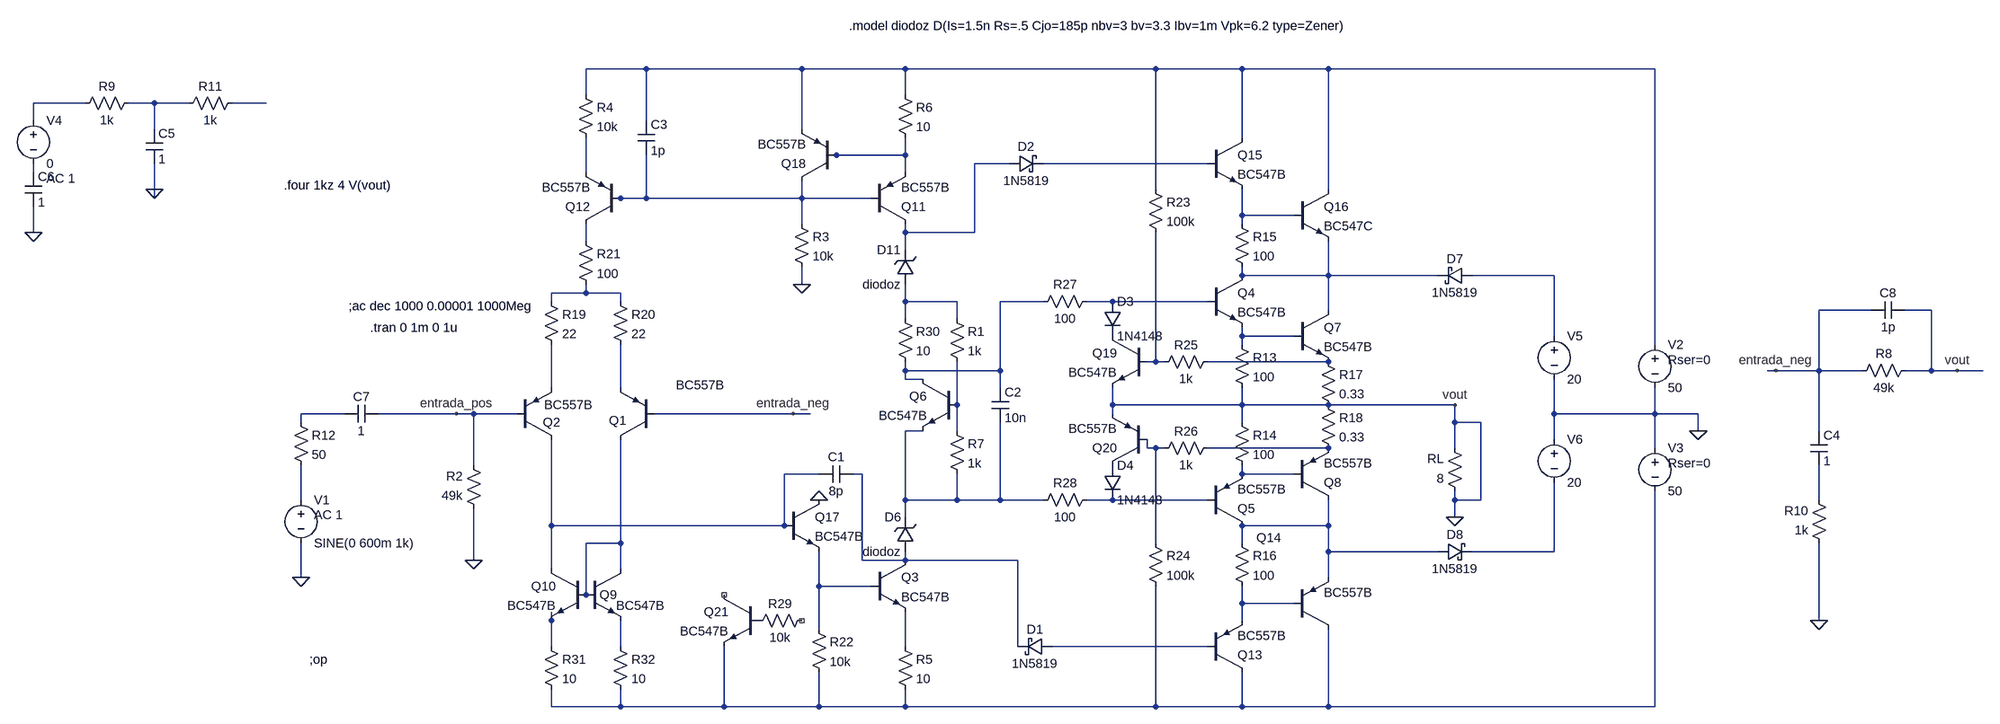
[diagram p0: schematic amplificador clase G con protecciones _ 2.asc]
amplificador clase G con protecciones _ 2.asc, the LTspice schematic file:
Version 4
SHEET 1 1412 756
WIRE -9376 -3552 -9488 -3552
WIRE -9088 -3552 -9376 -3552
WIRE -8896 -3552 -9088 -3552
WIRE -8432 -3552 -8896 -3552
WIRE -8272 -3552 -8432 -3552
WIRE -8112 -3552 -8272 -3552
WIRE -7360 -3552 -8112 -3552
WIRE -9488 -3504 -9488 -3552
WIRE -8896 -3504 -8896 -3552
WIRE -10416 -3488 -10512 -3488
WIRE -10288 -3488 -10336 -3488
WIRE -10224 -3488 -10288 -3488
WIRE -10080 -3488 -10144 -3488
WIRE -10512 -3456 -10512 -3488
WIRE -9376 -3456 -9376 -3552
WIRE -10288 -3440 -10288 -3488
WIRE -9088 -3440 -9088 -3552
WIRE -8272 -3424 -8272 -3552
WIRE -9024 -3392 -9040 -3392
WIRE -8896 -3392 -8896 -3424
WIRE -8896 -3392 -9024 -3392
WIRE -8704 -3376 -8768 -3376
WIRE -8336 -3376 -8640 -3376
WIRE -10512 -3360 -10512 -3376
WIRE -9488 -3360 -9488 -3424
WIRE -8896 -3360 -8896 -3392
WIRE -10288 -3328 -10288 -3376
WIRE -8432 -3328 -8432 -3552
WIRE -8112 -3328 -8112 -3552
WIRE -10288 -3312 -10288 -3328
WIRE -9424 -3312 -9440 -3312
WIRE -9376 -3312 -9376 -3392
WIRE -9376 -3312 -9424 -3312
WIRE -9088 -3312 -9088 -3344
WIRE -9088 -3312 -9376 -3312
WIRE -8960 -3312 -9088 -3312
WIRE -8272 -3280 -8272 -3328
WIRE -8176 -3280 -8272 -3280
WIRE -9088 -3264 -9088 -3312
WIRE -8272 -3264 -8272 -3280
WIRE -10512 -3248 -10512 -3296
WIRE -8896 -3248 -8896 -3264
WIRE -8768 -3248 -8768 -3376
WIRE -8768 -3248 -8896 -3248
WIRE -9488 -3232 -9488 -3264
WIRE -8896 -3216 -8896 -3248
WIRE -8272 -3168 -8272 -3184
WIRE -8112 -3168 -8112 -3232
WIRE -8112 -3168 -8272 -3168
WIRE -7888 -3168 -8112 -3168
WIRE -7600 -3168 -7824 -3168
WIRE -9088 -3152 -9088 -3184
WIRE -9488 -3136 -9488 -3152
WIRE -9488 -3136 -9552 -3136
WIRE -9424 -3136 -9488 -3136
WIRE -9552 -3120 -9552 -3136
WIRE -9424 -3120 -9424 -3136
WIRE -8896 -3120 -8896 -3152
WIRE -8800 -3120 -8896 -3120
WIRE -8640 -3120 -8720 -3120
WIRE -8512 -3120 -8560 -3120
WIRE -8336 -3120 -8512 -3120
WIRE -8112 -3104 -8112 -3168
WIRE -6960 -3104 -7056 -3104
WIRE -6848 -3104 -6896 -3104
WIRE -8896 -3088 -8896 -3120
WIRE -8800 -3088 -8800 -3120
WIRE -8272 -3056 -8272 -3072
WIRE -8176 -3056 -8272 -3056
WIRE -7600 -3056 -7600 -3168
WIRE -8272 -3040 -8272 -3056
WIRE -7360 -3040 -7360 -3552
WIRE -8432 -3008 -8432 -3248
WIRE -8432 -3008 -8448 -3008
WIRE -8416 -3008 -8432 -3008
WIRE -8112 -3008 -8336 -3008
WIRE -8896 -2992 -8896 -3008
WIRE -8720 -2992 -8720 -3120
WIRE -8720 -2992 -8896 -2992
WIRE -7136 -2992 -7152 -2992
WIRE -7056 -2992 -7056 -3104
WIRE -7056 -2992 -7136 -2992
WIRE -6976 -2992 -7056 -2992
WIRE -6848 -2992 -6848 -3104
WIRE -6848 -2992 -6896 -2992
WIRE -6800 -2992 -6848 -2992
WIRE -6752 -2992 -6800 -2992
WIRE -8896 -2976 -8896 -2992
WIRE -8864 -2976 -8896 -2976
WIRE -9552 -2960 -9552 -3040
WIRE -9424 -2960 -9424 -3040
WIRE -8720 -2960 -8720 -2992
WIRE -8800 -2928 -8800 -3008
WIRE -8512 -2928 -8512 -2960
WIRE -8272 -2928 -8272 -2960
WIRE -8272 -2928 -8512 -2928
WIRE -8112 -2928 -8272 -2928
WIRE -7856 -2928 -8112 -2928
WIRE -9936 -2912 -10016 -2912
WIRE -9728 -2912 -9872 -2912
WIRE -9696 -2912 -9728 -2912
WIRE -9616 -2912 -9696 -2912
WIRE -9104 -2912 -9360 -2912
WIRE -9072 -2912 -9104 -2912
WIRE -8512 -2912 -8512 -2928
WIRE -7600 -2912 -7600 -2976
WIRE -7360 -2912 -7360 -2960
WIRE -7360 -2912 -7600 -2912
WIRE -7280 -2912 -7360 -2912
WIRE -10016 -2896 -10016 -2912
WIRE -8272 -2896 -8272 -2928
WIRE -7856 -2896 -7856 -2928
WIRE -7808 -2896 -7856 -2896
WIRE -8864 -2880 -8896 -2880
WIRE -8800 -2880 -8800 -2928
WIRE -7280 -2880 -7280 -2912
WIRE -7056 -2880 -7056 -2992
WIRE -7600 -2864 -7600 -2912
WIRE -8448 -2848 -8448 -2864
WIRE -8432 -2848 -8448 -2848
WIRE -8416 -2848 -8432 -2848
WIRE -8112 -2848 -8336 -2848
WIRE -7856 -2848 -7856 -2896
WIRE -7360 -2848 -7360 -2912
WIRE -9696 -2816 -9696 -2912
WIRE -9056 -2800 -9120 -2800
WIRE -8976 -2800 -8992 -2800
WIRE -8272 -2800 -8272 -2816
WIRE -8176 -2800 -8272 -2800
WIRE -10016 -2752 -10016 -2816
WIRE -8896 -2752 -8896 -2880
WIRE -8800 -2752 -8800 -2800
WIRE -8800 -2752 -8896 -2752
WIRE -8720 -2752 -8720 -2896
WIRE -8720 -2752 -8800 -2752
WIRE -8640 -2752 -8720 -2752
WIRE -8512 -2752 -8560 -2752
WIRE -8336 -2752 -8512 -2752
WIRE -7856 -2752 -7856 -2768
WIRE -7808 -2752 -7808 -2896
WIRE -7808 -2752 -7856 -2752
WIRE -7056 -2752 -7056 -2816
WIRE -8896 -2720 -8896 -2752
WIRE -7856 -2720 -7856 -2752
WIRE -9552 -2704 -9552 -2864
WIRE -9120 -2704 -9120 -2800
WIRE -9120 -2704 -9552 -2704
WIRE -8112 -2704 -8112 -2752
WIRE -8112 -2704 -8272 -2704
WIRE -9424 -2672 -9424 -2864
WIRE -9424 -2672 -9488 -2672
WIRE -8432 -2672 -8432 -2848
WIRE -8272 -2672 -8272 -2704
WIRE -8112 -2656 -8112 -2704
WIRE -7888 -2656 -8112 -2656
WIRE -7600 -2656 -7600 -2784
WIRE -7600 -2656 -7824 -2656
WIRE -9696 -2640 -9696 -2736
WIRE -8976 -2640 -8976 -2800
WIRE -8896 -2640 -8896 -2656
WIRE -8896 -2640 -8976 -2640
WIRE -8688 -2640 -8896 -2640
WIRE -9552 -2624 -9552 -2704
WIRE -9424 -2624 -9424 -2672
WIRE -10016 -2608 -10016 -2672
WIRE -8112 -2608 -8112 -2656
WIRE -9056 -2592 -9056 -2656
WIRE -8960 -2592 -9056 -2592
WIRE -9488 -2576 -9488 -2672
WIRE -8272 -2560 -8272 -2592
WIRE -8176 -2560 -8272 -2560
WIRE -9552 -2528 -9552 -2544
WIRE -8272 -2528 -8272 -2560
WIRE -7056 -2528 -7056 -2672
WIRE -9056 -2512 -9056 -2592
WIRE -9552 -2480 -9552 -2528
WIRE -9424 -2480 -9424 -2528
WIRE -8896 -2480 -8896 -2544
WIRE -8688 -2480 -8688 -2640
WIRE -8336 -2480 -8624 -2480
WIRE -9552 -2368 -9552 -2400
WIRE -9424 -2368 -9424 -2400
WIRE -9424 -2368 -9552 -2368
WIRE -9232 -2368 -9232 -2480
WIRE -9232 -2368 -9424 -2368
WIRE -9056 -2368 -9056 -2432
WIRE -9056 -2368 -9232 -2368
WIRE -8896 -2368 -8896 -2400
WIRE -8896 -2368 -9056 -2368
WIRE -8432 -2368 -8432 -2592
WIRE -8432 -2368 -8896 -2368
WIRE -8272 -2368 -8272 -2432
WIRE -8272 -2368 -8432 -2368
WIRE -8112 -2368 -8112 -2512
WIRE -8112 -2368 -8272 -2368
WIRE -7360 -2368 -7360 -2768
WIRE -7360 -2368 -8112 -2368
FLAG -7280 -2880 0
FLAG -9696 -2640 0
FLAG -7856 -2720 0
FLAG -7856 -2928 vout
FLAG -10288 -3328 0
FLAG -10512 -3248 0
FLAG -10016 -2608 0
FLAG -7056 -2528 0
FLAG -7136 -2992 entrada_neg
FLAG -9104 -2912 entrada_neg
FLAG -6800 -2992 vout
FLAG -9728 -2912 entrada_pos
FLAG -9088 -3152 0
FLAG -9056 -2752 0
SYMBOL res -9504 -3520 R0
SYMATTR InstName R4
SYMATTR Value 10k
SYMBOL res -9680 -2720 R180
WINDOW 0 36 76 Left 2
WINDOW 3 36 40 Left 2
SYMATTR InstName R2
SYMATTR Value 49k
SYMBOL res -8912 -2496 R0
SYMATTR InstName R5
SYMATTR Value 10
SYMBOL res -8912 -3520 R0
SYMATTR InstName R6
SYMATTR Value 10
SYMBOL res -6880 -3008 R90
WINDOW 0 0 56 VBottom 2
WINDOW 3 32 56 VTop 2
SYMATTR InstName R8
SYMATTR Value 49k
SYMBOL res -7040 -2656 R180
WINDOW 0 36 76 Left 2
WINDOW 3 36 40 Left 2
SYMATTR InstName R10
SYMATTR Value 1k
SYMBOL res -7840 -2752 R180
WINDOW 0 36 76 Left 2
WINDOW 3 36 40 Left 2
SYMATTR InstName RL
SYMATTR Value 8
SYMBOL voltage -7360 -3056 R0
WINDOW 123 0 0 Left 2
WINDOW 39 24 44 Left 2
SYMATTR SpiceLine Rser=0
SYMATTR InstName V2
SYMATTR Value 50
SYMBOL voltage -7360 -2864 R0
WINDOW 123 0 0 Left 2
WINDOW 39 24 44 Left 2
SYMATTR SpiceLine Rser=0
SYMATTR InstName V3
SYMATTR Value 50
SYMBOL pnp -9360 -2864 R180
WINDOW 0 53 35 Left 2
WINDOW 3 -128 101 Left 2
SYMATTR InstName Q1
SYMATTR Value BC557B
SYMBOL pnp -9616 -2864 M180
WINDOW 0 48 32 Left 2
WINDOW 3 51 64 Left 2
SYMATTR InstName Q2
SYMATTR Value BC557B
SYMBOL npn -8960 -2640 R0
SYMATTR InstName Q3
SYMATTR Value BC547B
SYMBOL npn -8336 -3168 R0
SYMATTR InstName Q4
SYMATTR Value BC547B
SYMBOL cap -7072 -2880 R0
SYMATTR InstName C4
SYMATTR Value 1
SYMBOL pnp -8336 -2704 M180
SYMATTR InstName Q5
SYMATTR Value BC557B
SYMBOL npn -8800 -2976 M0
SYMATTR InstName Q6
SYMATTR Value BC547B
SYMBOL res -8816 -3104 R0
SYMATTR Value 1k
SYMATTR InstName R1
SYMBOL res -8816 -2896 R0
SYMATTR InstName R7
SYMATTR Value 1k
SYMBOL cap -8736 -2960 R0
SYMATTR InstName C2
SYMATTR Value 10n
SYMBOL res -10320 -3504 R90
WINDOW 0 0 56 VBottom 2
WINDOW 3 32 56 VTop 2
SYMATTR InstName R9
SYMATTR Value 1k
SYMBOL res -10128 -3504 R90
WINDOW 0 0 56 VBottom 2
WINDOW 3 32 56 VTop 2
SYMATTR InstName R11
SYMATTR Value 1k
SYMBOL cap -10304 -3440 R0
SYMATTR InstName C5
SYMATTR Value 1
SYMBOL cap -10528 -3360 R0
SYMATTR InstName C6
SYMATTR Value 1
SYMBOL voltage -10512 -3472 R0
WINDOW 123 24 124 Left 2
WINDOW 39 0 0 Left 2
SYMATTR Value2 AC 1
SYMATTR InstName V4
SYMATTR Value 0
SYMBOL voltage -10016 -2768 R0
WINDOW 123 24 44 Left 2
WINDOW 39 0 0 Left 2
SYMATTR Value2 AC 1
SYMATTR InstName V1
SYMATTR Value SINE(0 600m 1k)
SYMBOL res -10032 -2912 R0
SYMATTR InstName R12
SYMATTR Value 50
SYMBOL cap -9872 -2928 R90
WINDOW 0 0 32 VBottom 2
WINDOW 3 32 32 VTop 2
SYMATTR InstName C7
SYMATTR Value 1
SYMBOL npn -8176 -3104 R0
SYMATTR InstName Q7
SYMATTR Value BC547B
SYMBOL pnp -8176 -2752 M180
SYMATTR InstName Q8
SYMATTR Value BC557B
SYMBOL res -8288 -3056 R0
SYMATTR InstName R13
SYMATTR Value 100
SYMBOL res -8288 -2912 R0
SYMATTR InstName R14
SYMATTR Value 100
SYMBOL npn -9488 -2624 R0
WINDOW 0 25 48 Left 2
SYMATTR InstName Q9
SYMATTR Value BC547B
SYMBOL npn -9488 -2624 M0
SYMATTR InstName Q10
SYMATTR Value BC547B
SYMBOL pnp -8960 -3264 M180
SYMATTR InstName Q11
SYMATTR Value BC557B
SYMBOL pnp -9424 -3264 R180
SYMATTR InstName Q12
SYMATTR Value BC557B
SYMBOL pnp -8336 -2432 M180
SYMATTR InstName Q13
SYMATTR Value BC557B
SYMBOL pnp -8176 -2512 M180
WINDOW 0 -69 170 Left 2
SYMATTR InstName Q14
SYMATTR Value BC557B
SYMBOL npn -8336 -3424 R0
SYMATTR InstName Q15
SYMATTR Value BC547B
SYMBOL npn -8176 -3328 R0
SYMATTR InstName Q16
SYMATTR Value BC547C
SYMBOL res -8288 -3280 R0
SYMATTR InstName R15
SYMATTR Value 100
SYMBOL res -8288 -2688 R0
SYMATTR InstName R16
SYMATTR Value 100
SYMBOL zener -8880 -3152 R180
WINDOW 0 24 64 Left 2
WINDOW 3 24 0 Left 2
SYMATTR InstName D11
SYMATTR Value diodoz
SYMBOL zener -8880 -2656 R180
WINDOW 0 24 64 Left 2
WINDOW 3 24 0 Left 2
SYMATTR InstName D6
SYMATTR Value diodoz
SYMBOL schottky -7824 -3184 R90
WINDOW 0 0 32 VBottom 2
WINDOW 3 32 32 VTop 2
SYMATTR InstName D7
SYMATTR Value 1N5819
SYMBOL schottky -7888 -2640 R270
WINDOW 0 32 32 VTop 2
WINDOW 3 0 32 VBottom 2
SYMATTR InstName D8
SYMATTR Value 1N5819
SYMBOL voltage -7600 -3072 R0
WINDOW 123 0 0 Left 2
WINDOW 39 0 0 Left 2
SYMATTR InstName V5
SYMATTR Value 20
SYMBOL voltage -7600 -2880 R0
WINDOW 123 0 0 Left 2
WINDOW 39 0 0 Left 2
SYMATTR InstName V6
SYMATTR Value 20
SYMBOL npn -9120 -2752 R0
SYMATTR InstName Q17
SYMATTR Value BC547B
SYMBOL pnp -9024 -3344 R180
SYMATTR InstName Q18
SYMATTR Value BC557B
SYMBOL res -9104 -3280 R0
SYMATTR InstName R3
SYMATTR Value 10k
SYMBOL res -8128 -3024 R0
SYMATTR InstName R17
SYMATTR Value 0.33
SYMBOL res -8128 -2944 R0
SYMATTR InstName R18
SYMATTR Value 0.33
SYMBOL res -9568 -3136 R0
SYMATTR InstName R19
SYMATTR Value 22
SYMBOL res -9440 -3136 R0
SYMATTR InstName R20
SYMATTR Value 22
SYMBOL res -9504 -3248 R0
SYMATTR InstName R21
SYMATTR Value 100
SYMBOL cap -8992 -2816 R90
WINDOW 0 0 32 VBottom 2
WINDOW 3 32 32 VTop 2
SYMATTR InstName C1
SYMATTR Value 8p
SYMBOL res -9072 -2528 R0
SYMATTR InstName R22
SYMATTR Value 10k
SYMBOL cap -6896 -3120 R90
WINDOW 0 0 32 VBottom 2
WINDOW 3 32 32 VTop 2
SYMATTR InstName C8
SYMATTR Value 1p
SYMBOL schottky -8624 -2496 R90
WINDOW 0 0 32 VBottom 2
WINDOW 3 32 32 VTop 2
SYMATTR InstName D1
SYMATTR Value 1N5819
SYMBOL schottky -8704 -3360 R270
WINDOW 0 32 32 VTop 2
WINDOW 3 0 32 VBottom 2
SYMATTR InstName D2
SYMATTR Value 1N5819
SYMBOL npn -8448 -3056 M0
SYMATTR InstName Q19
SYMATTR Value BC547B
SYMBOL pnp -8448 -2816 R180
SYMATTR InstName Q20
SYMATTR Value BC557B
SYMBOL res -8448 -3344 R0
SYMATTR InstName R23
SYMATTR Value 100k
SYMBOL res -8448 -2688 R0
SYMATTR InstName R24
SYMATTR Value 100k
SYMBOL res -8320 -3024 R90
WINDOW 0 0 56 VBottom 2
WINDOW 3 32 56 VTop 2
SYMATTR InstName R25
SYMATTR Value 1k
SYMBOL res -8320 -2864 R90
WINDOW 0 0 56 VBottom 2
WINDOW 3 32 56 VTop 2
SYMATTR InstName R26
SYMATTR Value 1k
SYMBOL diode -8528 -3120 R0
SYMATTR InstName D3
SYMATTR Value 1N4148
SYMBOL diode -8528 -2816 R0
SYMATTR InstName D4
SYMATTR Value 1N4148
SYMBOL res -8544 -3136 R90
WINDOW 0 0 56 VBottom 2
WINDOW 3 32 56 VTop 2
SYMATTR InstName R27
SYMATTR Value 100
SYMBOL res -8544 -2768 R90
WINDOW 0 0 56 VBottom 2
WINDOW 3 32 56 VTop 2
SYMATTR InstName R28
SYMATTR Value 100
SYMBOL res -8912 -3104 R0
SYMATTR InstName R30
SYMATTR Value 10
SYMBOL res -9568 -2496 R0
SYMATTR InstName R31
SYMATTR Value 10
SYMBOL res -9440 -2496 R0
SYMATTR InstName R32
SYMATTR Value 10
SYMBOL npn -9168 -2576 M0
SYMATTR InstName Q21
SYMATTR Value BC547B
SYMBOL res -9072 -2544 R90
WINDOW 0 0 56 VBottom 2
WINDOW 3 32 56 VTop 2
SYMATTR InstName R29
SYMATTR Value 10k
SYMBOL cap -9392 -3456 R0
SYMATTR InstName C3
SYMATTR Value 1p
TEXT -10000 -2456 Left 2 !;op
TEXT -9888 -3072 Left 2 !.tran 0 1m 0 1u
TEXT -9928 -3112 Left 2 !;ac dec 1000 0.00001 1000Meg
TEXT -10048 -3336 Left 2 !.four 1kz 4 V(vout)
TEXT -9000 -3632 Left 2 !.model diodoz D(Is=1.5n Rs=.5 Cjo=185p nbv=3 bv=3.3 Ibv=1m Vpk=6.2 type=Zener)

The netlist it stands for:
* amplificador clase G con protecciones _ 2.asc
R4 N001 N009 10k
R2 0 entrada_pos 49k
R5 N042 N044 10
R6 N001 N005 10
R8 0 entrada_neg 49k
R10 0 N034 1k
RL 0 0 8
V2 N001 0 50 Rser=0
V3 0 N044 50 Rser=0
Q1 N036 entrada_neg N023 0 BC557B
Q2 N029 entrada_pos N022 0 BC557B
Q3 N030 N038 N042 0 BC547B
Q4 N013 N018 N019 0 BC547B
C4 entrada_neg N034 1
Q5 N035 N033 N031 0 BC557B
Q6 N017 N024 N026 0 BC547B
R1 N016 N024 1k
R7 N024 N026 1k
C2 N017 N026 10n
R9 N003 N002 1k
R11 N004 N003 1k
C5 N003 0 1
C6 N008 0 1
V4 N002 N008 0 AC 1
V1 N032 0 SINE(0 600m 1k) AC 1
R12 N025 N032 50
C7 entrada_pos N025 1
Q7 N013 N019 N021 0 BC547B
Q8 N035 N031 N028 0 BC557B
R13 N019 0 100
R14 0 N031 100
Q9 N036 N036 N041 0 BC547B
Q10 N029 N036 N040 0 BC547B
Q11 N006 N010 N005 0 BC557B
Q12 N012 N010 N009 0 BC557B
Q13 N044 N043 N039 0 BC557B
Q14 N044 N039 N035 0 BC557B
Q15 N001 N007 N011 0 BC547B
Q16 N001 N011 N013 0 BC547C
R15 N011 N013 100
R16 N035 N039 100
D11 N016 N006 diodoz
D6 N030 N026 diodoz
D7 N014 N013 1N5819
D8 N035 N037 1N5819
V5 N014 0 20
V6 0 N037 20
Q17 0 N029 N038 0 BC547B
Q18 N010 N005 N001 0 BC557B
R3 N010 0 10k
R17 N021 0 0.33
R18 0 N028 0.33
R19 N015 N022 22
R20 N015 N023 22
R21 N012 N015 100
C1 N030 N029 8p
R22 N038 N044 10k
C8 0 entrada_neg 1p
D1 N043 N030 1N5819
D2 N006 N007 1N5819
Q19 P001 N020 0 0 BC547B
Q20 P002 N027 0 0 BC557B
R23 N001 N020 100k
R24 N027 N044 100k
R25 N021 N020 1k
R26 N028 N027 1k
D3 N018 P001 1N4148
D4 P002 N033 1N4148
R27 N018 N017 100
R28 N033 N026 100
R30 N016 N017 10
R31 N040 N044 10
R32 N041 N044 10
Q21 NC_01 P003 N044 0 BC547B
R29 NC_02 P003 10k
C3 N001 N010 1p
.model D D
.lib standard.dio
.model NPN NPN
.model PNP PNP
.lib standard.bjt
;op
.tran 0 1m 0 1u
;ac dec 1000 0.00001 1000Meg
.four 1kz 4 V(vout)
.model diodoz D(Is=1.5n Rs=.5 Cjo=185p nbv=3 bv=3.3 Ibv=1m Vpk=6.2 type=Zener)
.backanno
.end